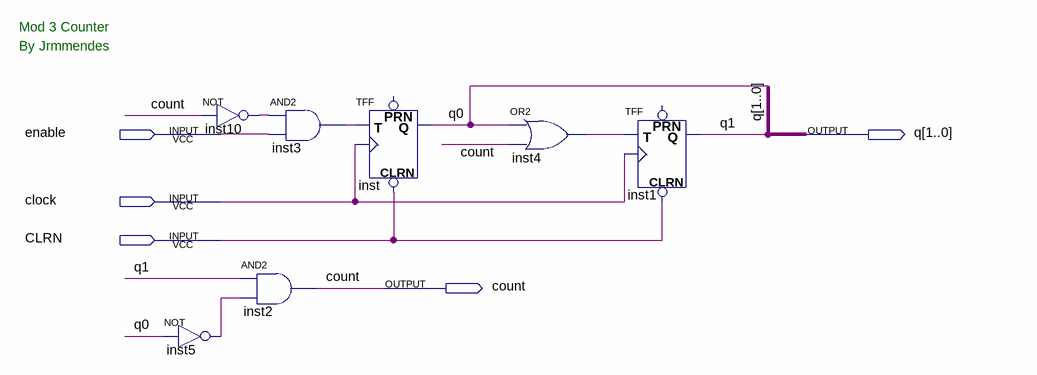
[diagram p0: schematic sheet]
// Quartus schematic mod_3_counter.bdf as structural Verilog: 7 symbols, 5 pins
module mod_3_counter (
  input  enable,
  input  clock,
  input  CLRN,
  output [1:0] q,
  output count
);

  wire inst3_out, inst4_out, inst5_out, inst10_out;

  not inst5 (inst5_out, q[0]);
  not inst10 (inst10_out, count);
  and inst2 (count, q[1], inst5_out);
  and inst3 (inst3_out, inst10_out, enable);
  TFF inst (.CLRN(CLRN), .T(inst3_out), .CLK(clock), .Q(q[0]));  // open: PRN
  or inst4 (inst4_out, q[0], count);
  TFF inst1 (.CLRN(CLRN), .T(inst4_out), .CLK(clock), .Q(q[1]));  // open: PRN

  // Notes on the sheet:
  //   Mod 3 Counter
  //   By Jrmmendes
endmodule
